# EAGLE design FormulaControls (EAGLE 9.6.2)
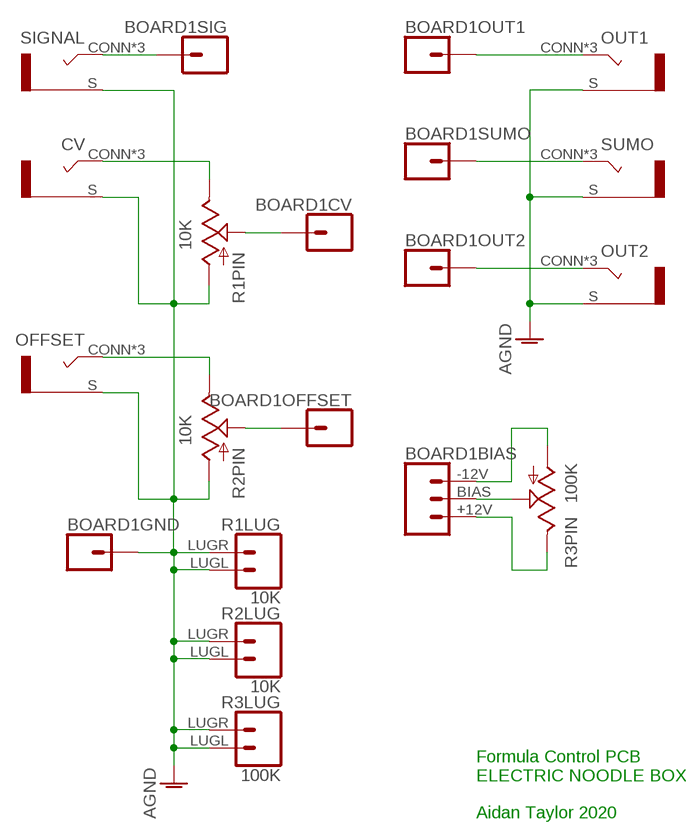
[diagram p0: schematic, sheet 1]

## Parts
BOARD1  FORMULA_LINK  [FORMULA]
CV  COMBI-JACKCINCHNANA  [NEWCOMBOJACK_PANEL]
OFFSET  COMBI-JACKCINCHNANA  [NEWCOMBOJACK_PANEL]
OUT1  COMBI-JACKCINCHNANA  [NEWCOMBOJACK_PANEL]
OUT2  COMBI-JACKCINCHNANA  [NEWCOMBOJACK_PANEL]
R1  10K  POTENTIOMETER  [ALPHA_RV09_9MMPOT]
R2  10K  POTENTIOMETER  [ALPHA_RV09_9MMPOT]
R3  100K  POTENTIOMETER  [ALPHA_RV09_9MMPOT]
SIGNAL  COMBI-JACKCINCHNANA  [NEWCOMBOJACK_PANEL]
SUMO  COMBI-JACKCINCHNANA  [NEWCOMBOJACK_PANEL]

## Nets
AGND: BOARD1.GND CV.S OFFSET.S OUT1.S OUT2.S R1.C1(PIN:A) R1.LUGL R1.LUGR R2.C1(PIN:A) R2.LUGL R2.LUGR R3.LUGL R3.LUGR SIGNAL.S SUMO.S
N$1: BOARD1.SIG SIGNAL.CONN(T) SIGNAL.T1(T) SIGNAL.T2(T)
N$2: CV.CONN(T) CV.T1(T) CV.T2(T) R1.C3(PIN:B)
N$3: BOARD1.OUT1 OUT1.CONN(T) OUT1.T1(T) OUT1.T2(T)
N$4: BOARD1.CV R1.C2(PIN:W)
N$5: OFFSET.CONN(T) OFFSET.T1(T) OFFSET.T2(T) R2.C3(PIN:B)
N$6: BOARD1.BIAS R3.C2(PIN:W)
N$7: BOARD1.OFFSET R2.C2(PIN:W)
N$8: BOARD1.SUMO SUMO.CONN(T) SUMO.T1(T) SUMO.T2(T)
N$9: BOARD1.OUT2 OUT2.CONN(T) OUT2.T1(T) OUT2.T2(T)
N$10: BOARD1.-12V R3.C1(PIN:A)
N$11: BOARD1.+12V R3.C3(PIN:B)

## Notes on the sheet
- Formula Control PCB
  ELECTRIC NOODLE BOX
  
  Aidan Taylor 2020

## Library data of the parts
BOARD1 = ElectricNoodleBox:FORMULA_LINK
CV OFFSET OUT1 OUT2 SIGNAL SUMO = ElectricNoodleBox:COMBI-JACK
R1-R3 = ElectricNoodleBox:POTENTIOMETER

## Board
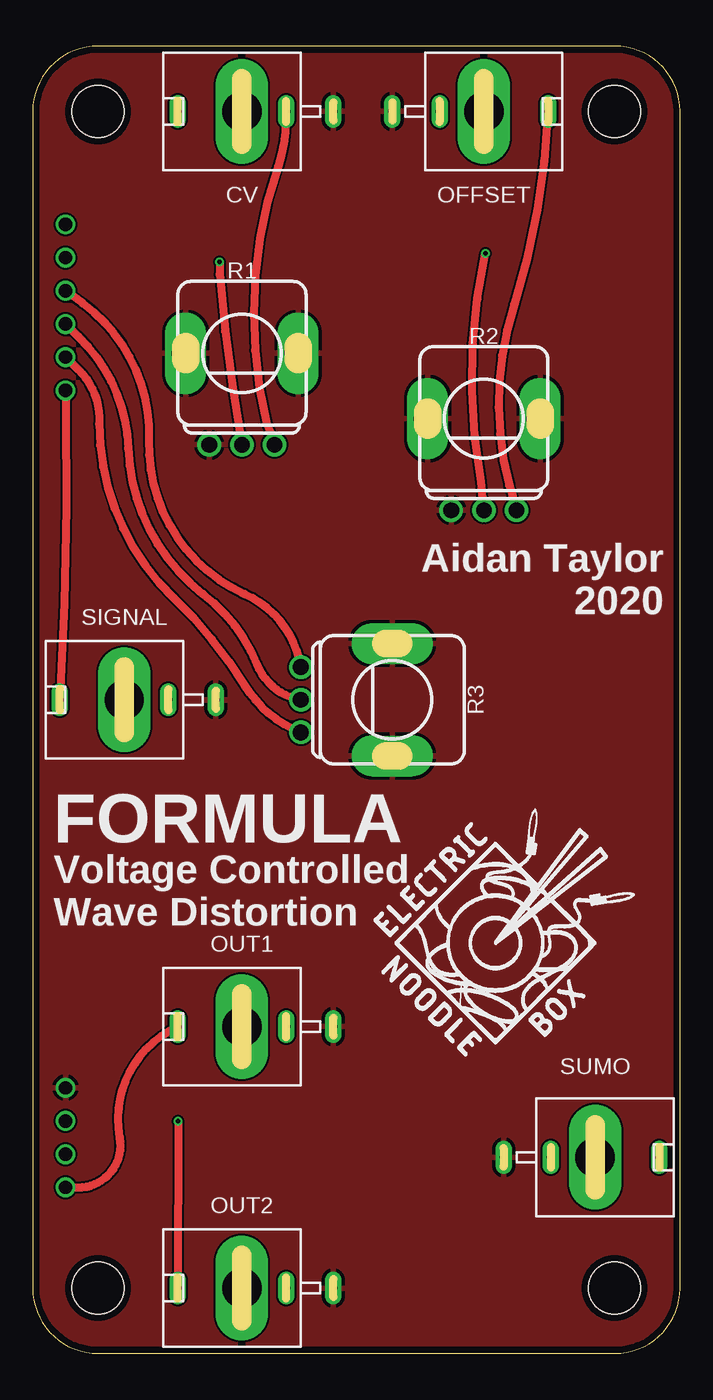
[diagram p1: board, top side]
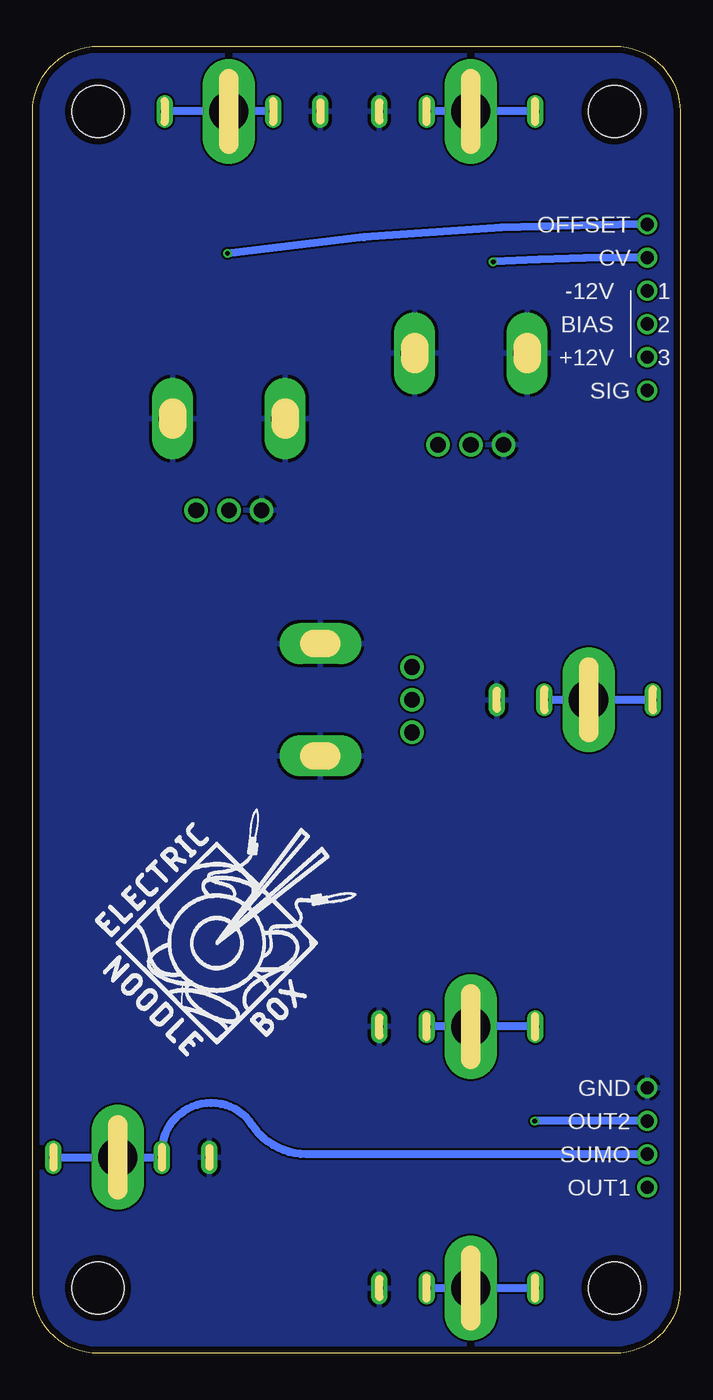
[diagram p2: board, bottom side, seen from below]

Size 49.5 x 100 mm. Coordinates in mm from the lower left corner, seen from the top.
Outline: 0,95 0,5 arc90 5,0 44.5,0 arc90 49.5,5 49.5,95 arc90 44.5,100 5,100 arc90 0,95
Copper layers (1*16): Top 0.035mm / dielectric 1.6mm / Bottom 0.035mm
Design rules "Elecrow_2-layer_PCB_eagle_rule": minimum track width 6mil, minimum drill 12mil, track to track 6mil, track to pad 6mil, pad to pad 6mil, via to via 8mil, smd to smd 0mil, copper to edge 20mil, drill to drill 10mil, minimum pad ring 6mil, minimum via ring 6mil, stop-mask expansion 0mil, vias tented up to drill 100mil, thermal gap 10mil

### Footprints (pad centres in the part's own frame; a part is rotated, then mirrored left to right if it is on the bottom)
FORMULA = drill 1.016: +12V 46.99,76.2; -12V 46.99,81.28; BIAS 46.99,78.74; CV 46.99,83.82; GND 46.99,20.32; OFFSET 46.99,86.36; OUT1 46.99,12.7; OUT2 46.99,17.78; SIG 46.99,73.66; SUMO 46.99,15.24 | hole 4: 5,5; 44.5,5; 44.5,95; 5,95
NEWCOMBOJACK_PANEL = drill 3 pad 3.6 long: CONN 0,0 | drill 0.6 pad 1.27 long: S 0,-7; T1 0,4.92; T2 0,-3.38
ALPHA_RV09_9MMPOT = drill 1.2 pad 1.778: C1 -2.5,-7; C2 0,-7; C3 2.5,-7 | drill 2.1 pad 2.8 long: LUGL -4.3,0; LUGR 4.3,0

### Placement (x,y rotation side)
BOARD1  49.5,0 0 bottom
CV  16,95 90 top
OFFSET  34.5,95 270 top
OUT1  16,25 90 top
OUT2  16,5 90 top
R1  16,76.5 0 top
R2  34.5,71.5 0 top
R3  27.5,50 270 top
SIGNAL  7,50 90 top
SUMO  43,15 270 top
U$1  [LOGO20X20]  26.04,22.23 0 top
U$2  [LOGO20X20]  44.77,22.23 0 bottom

### Tracks (layer width: path | path; a pad name or v marks a point on that pad's centre or on a via)
AGND
  pour Top: 0,0 49.53,0 49.53,100.33 0,100.33
  pour Bottom: 0,0 49.53,0 49.53,100.33 0,100.33
N$1
  Top 0.61: BOARD1.SIG 2.54,72.07 arc-5 SIGNAL.T1
  Bottom 0.61: SIGNAL.T1 SIGNAL.CONN SIGNAL.T2
N$2
  Top 0.61: CV.T2 19.37,94.3 arc-18 18.76,90.81 arc32 17.9,71.07 arc-2 R1.C3
  Bottom 0.61: CV.T1 CV.CONN CV.T2
N$3
  Top 0.61: BOARD1.OUT1 3.49,12.7 arc100 6.67,16.51 arc-76 OUT1.T1
  Bottom 0.61: OUT1.T1 OUT1.CONN OUT1.T2
N$4  (via drill 0.35)
  Top 0.61: v14.29,83.5 14.29,82.55 arc6 R1.C2
  Bottom 0.61: BOARD1.CV 3.81,83.82 arc-3 v14.29,83.5
N$5
  Top 0.61: OFFSET.T1 39.37,94.95 arc-15 36.81,80.22 arc37 R2.C3
  Bottom 0.61: OFFSET.T2 OFFSET.CONN OFFSET.T1
N$6
  Top 0.61: BOARD1.BIAS 3.49,77.79 arc-44 7.3,69.22 arc50 13.02,58.1 arc-30 17.14,52.7 arc57 R3.C2
N$7  (via drill 0.35)
  Top 0.61: R2.C2 34.29,66.67 arc-22 v34.61,84.14
  Bottom 0.61: BOARD1.OFFSET 3.17,86.36 arc-8 v34.61,84.14
N$8
  Bottom 0.61: BOARD1.SUMO 28.57,15.24 arc57 32.7,17.46 arc-152 SUMO.T2 SUMO.CONN SUMO.T1
N$9  (via drill 0.35)
  Top 0.61: v11.11,17.78 OUT2.T1
  Bottom 0.61: BOARD1.OUT2 v11.11,17.78 | OUT2.T1 OUT2.CONN OUT2.T2
N$10
  Top 0.61: BOARD1.-12V 3.81,80.33 arc-56 8.89,69.85 arc68 16.19,58.1 arc-56 R3.C1
N$11
  Top 0.61: R3.C3 arc-37 16.19,51.12 arc15 10.79,57.78 arc-46 5.08,71.12 arc50 3.49,75.25 BOARD1.+12V

### Text on the board
tPlace: Aidan Taylor / 2020 | FORMULA | Voltage Controlled / Wave Distortion